# Altium project EECS_300_PCB1.PrjPcb
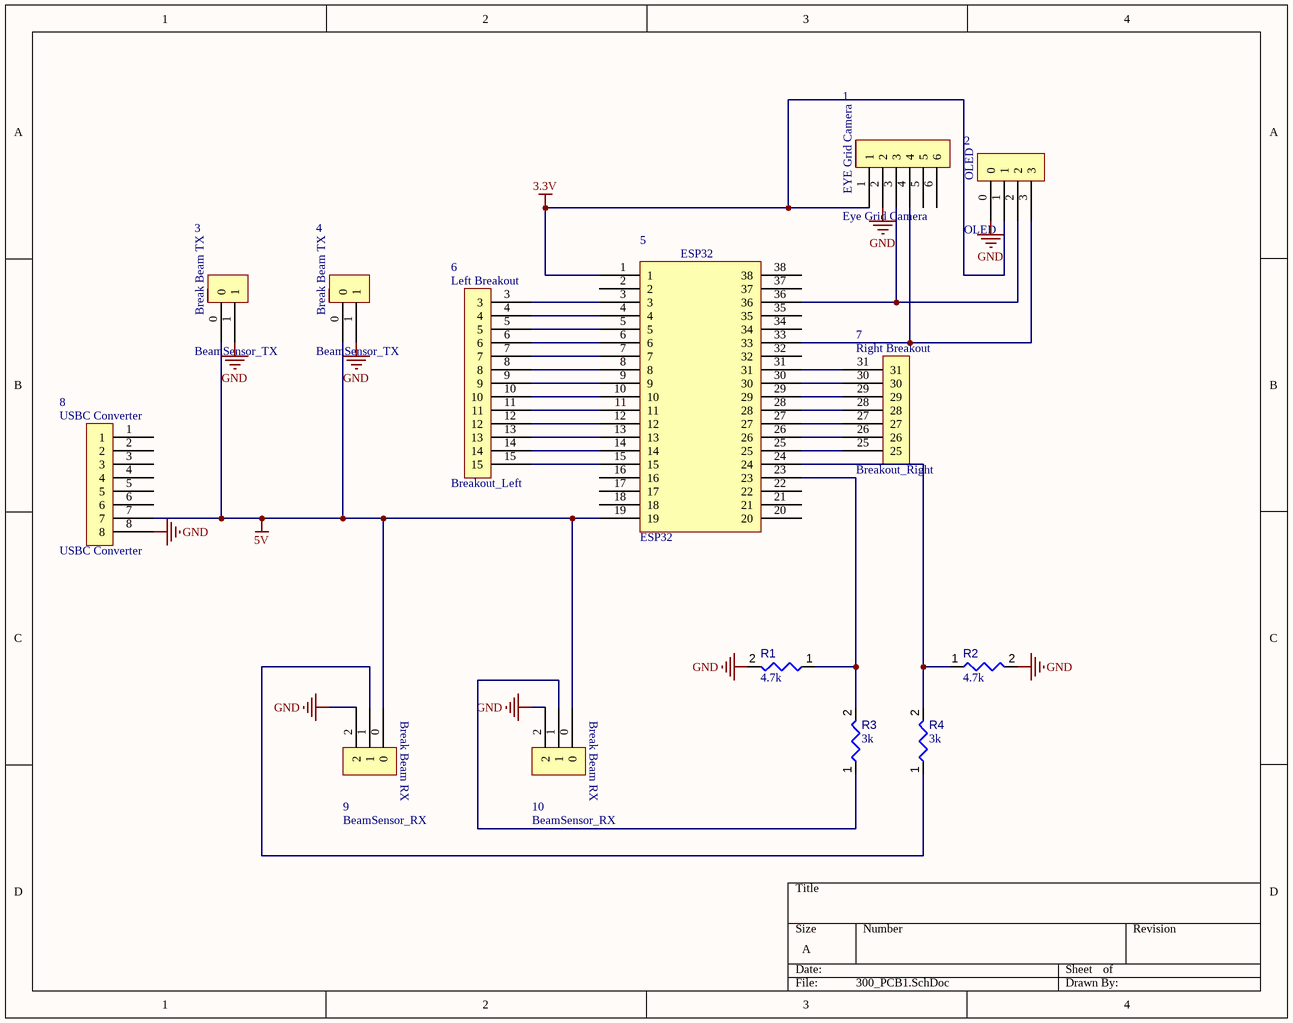
[diagram p0: 300_PCB1.SchDoc]
1 sheet, 14 parts. Net scope: global (net labels, ports and power ports of the same name join across sheets).
Board file: Updated_PCB.PcbDoc

## Sheet 300_PCB1.SchDoc: PCB_ESP32
size A; Revision: Rev3; SheetNumber: 1; SheetTotal: 1

### Parts
1  Eye Grid Camera  [IR Camera]
2  OLED  [OLED]
3  BeamSensor_TX  [Beam_TX]
4  BeamSensor_TX  [Beam_TX]
5  ESP32  [ESP32]
6  Breakout_Left  [Left Breakout]
7  Breakout_Right  [Breakout_Right]
8  USBC Converter  [USBC converter]
9  BeamSensor_RX  [Beam_RX]
10  BeamSensor_RX  [Beam_RX]
R1  value 4.7k  [RESC0402(1005)_L]  (hidden comment: 4D7KR2F)
R2  value 4.7k  [RESC0402(1005)_L]  (hidden comment: 4D7KR2F)
R3  value 3k  [RESC0402(1005)_L]  (hidden comment: 3KR2F)
R4  value 3k  [RESC0402(1005)_L]  (hidden comment: 3KR2F)

### Nets
3.3V: 1.1 2.1 5.1
5V: 3.0 4.0 5.19 8.7 9.0 10.0
GND: 1.2 2.0 3.1 4.1 8.8 9.2 10.2 R1.2 R2.2
Net1_3: 1.3 2.2 5.36
Net1_4: 1.4 2.3 5.33
Net5_3: 5.3 6.3
Net5_4: 5.4 6.4
Net5_5: 5.5 6.5
Net5_6: 5.6 6.6
Net5_7: 5.7 6.7
Net5_8: 5.8 6.8
Net5_9: 5.9 6.9
Net5_10: 5.10 6.10
Net5_11: 5.11 6.11
Net5_12: 5.12 6.12
Net5_13: 5.13 6.13
Net5_14: 5.14 6.14
Net5_15: 5.15 6.15
Net5_23: 5.23 R1.1 R3.2
Net5_24: 5.24 R2.1 R4.2
Net5_25: 5.25 7.25
Net5_26: 5.26 7.26
Net5_27: 5.27 7.27
Net5_28: 5.28 7.28
Net5_29: 5.29 7.29
Net5_30: 5.30 7.30
Net5_31: 5.31 7.31
Net9_1: 9.1 R4.1
Net10_1: 10.1 R3.1

Not connected (* = marked no-connect by the designer): 1 5 6; 5 2 16 17 18 20 21 22 32 34 35 37 38; 8 1 2 3 4 5 6

### Notes on the sheet
- (in symbol CMP-00001-1) Left Breakout
- (in symbol CMP-00002-1) Right Breakout
- (in symbol CMP-00003-3) Break Beam TX
- (in symbol CMP-00004-1) Break Beam RX
- (in symbol CMP-00006-1) EYE Grid Camera

### Library data of the parts
1 = CMP-00006-1: IR Camera
2 = CMP-00005-1: footprint of OLED display
3 4 = CMP-00003-3: pinout for the break beam sensor
5 = CMP-00000-1: first esp32 footprint
6 = CMP-00001-1: left breakout rail
7 = CMP-00002-1: right breakout rail
8 = CMP-00007-1: Converter for the power bank
9 10 = CMP-00004-1: pinout for the break beam sensor RX
R1 R2 = CMP-009-00105-2: 4K7 0.063W 1% 0402 (1005 Metric)  SMD; Power: 63mW; Mounting Technology: SMT; Case/Package: 0402; Tolerance: 1%; Pins: 2; Component Type: Resistors
R3 R4 = CMP-009-00099-2: 3K 0.063W 1% 0402 (1005 Metric)  SMD; Power: 63mW; Case/Package: 0402; Tolerance: 1%; Mounting Technology: SMT; Pins: 2; Component Type: Resistors